# EAGLE design M133A (EAGLE 6.6.0)
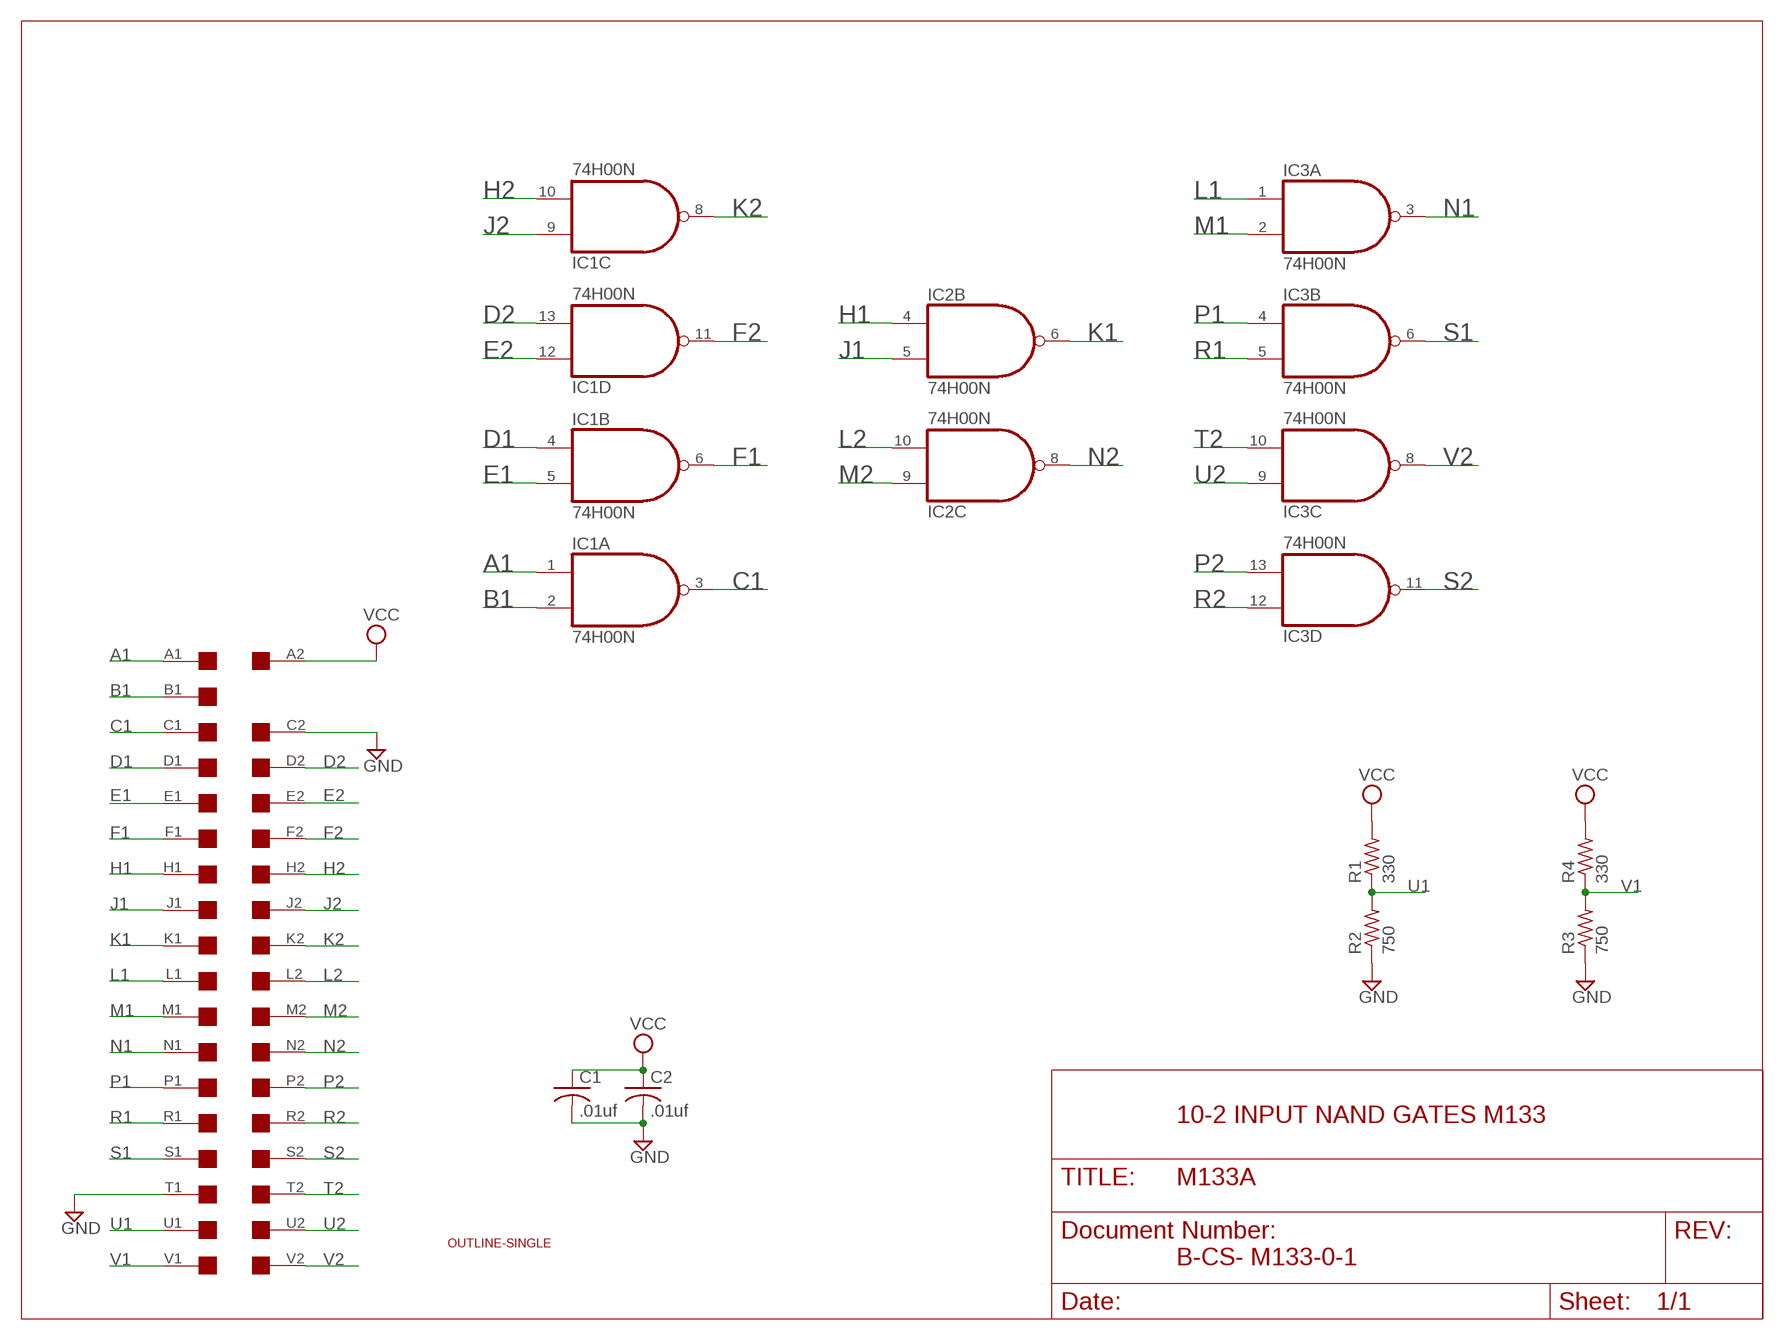
[diagram p0: schematic, sheet 1]

## Parts
C1  .01uf  C-US050-025X075  [C050-025X075]
C2  .01uf  C-US050-025X075  [C050-025X075]
IC1  74H00N  7400N  [DIL14]
IC2  74H00N  7400N  [DIL14]
IC3  74H00N  7400N  [DIL14]
R1  330  R-US_0207/10  [0207/10]
R2  750  R-US_0207/10  [0207/10]
R3  750  R-US_0207/10  [0207/10]
R4  330  R-US_0207/10  [0207/10]
U$1  OUTLINE-SINGLE  [SINGLE]
U$4  SINGLE  [EDGE-CON2]

## Nets
A1: IC1.1(A:I0) U$4.A1
B1: IC1.2(A:I1) U$4.B1
C1: IC1.3(A:O) U$4.C1
D1: IC1.4(B:I0) U$4.D1
D2: IC1.13(D:I1) U$4.D2
E1: IC1.5(B:I1) U$4.E1
E2: IC1.12(D:I0) U$4.E2
F1: IC1.6(B:O) U$4.F1
F2: IC1.11(D:O) U$4.F2
GND [Supply]: C1.2 C2.2 R2.1 R3.1 U$4.C2 U$4.T1
H1: IC2.4(B:I0) U$4.H1
H2: IC1.10(C:I1) U$4.H2
J1: IC2.5(B:I1) U$4.J1
J2: IC1.9(C:I0) U$4.J2
K1: IC2.6(B:O) U$4.K1
K2: IC1.8(C:O) U$4.K2
L1: IC3.1(A:I0) U$4.L1
L2: IC2.10(C:I1) U$4.L2
M1: IC3.2(A:I1) U$4.M1
M2: IC2.9(C:I0) U$4.M2
N1: IC3.3(A:O) U$4.N1
N2: IC2.8(C:O) U$4.N2
P1: IC3.4(B:I0) U$4.P1
P2: IC3.13(D:I1) U$4.P2
R1: IC3.5(B:I1) U$4.R1
R2: IC3.12(D:I0) U$4.R2
S1: IC3.6(B:O) U$4.S1
S2: IC3.11(D:O) U$4.S2
T2: IC3.10(C:I1) U$4.T2
U1: R1.1 R2.2 U$4.U1
U2: IC3.9(C:I0) U$4.U2
V1: R3.2 R4.1 U$4.V1
V2: IC3.8(C:O) U$4.V2
VCC [Supply]: C1.1 C2.1 R1.2 R4.2 U$4.A2
Unconnected: IC2.1(A:I0) IC2.2(A:I1) IC2.3(A:O) IC2.11(D:O) IC2.12(D:I0) IC2.13(D:I1) U$4.B2

## Notes on the sheet
- 10-2 INPUT NAND GATES M133
- B-CS- M133-0-1

## Power pins joined to a net without a drawn wire
GND: IC1.7(P:GND) IC2.7(P:GND) IC3.7(P:GND)
VCC: IC1.14(P:VCC) IC2.14(P:VCC) IC3.14(P:VCC)

## Library data of the parts
C1 C2 = rcl:C-US: CAPACITOR, American symbol
IC1-IC3 = 74xx-us:74*00: Quad 2-input NAND gate
R1-R4 = rcl:R-US_: RESISTOR, American symbol
U$1 = dec-con:OUTLINE-*: Board outlines for DEC boards.
U$4 = dec-con:SINGLE: Single-Height DEC board

## Net classes
1 Supply: width 0.813 mm

## Board
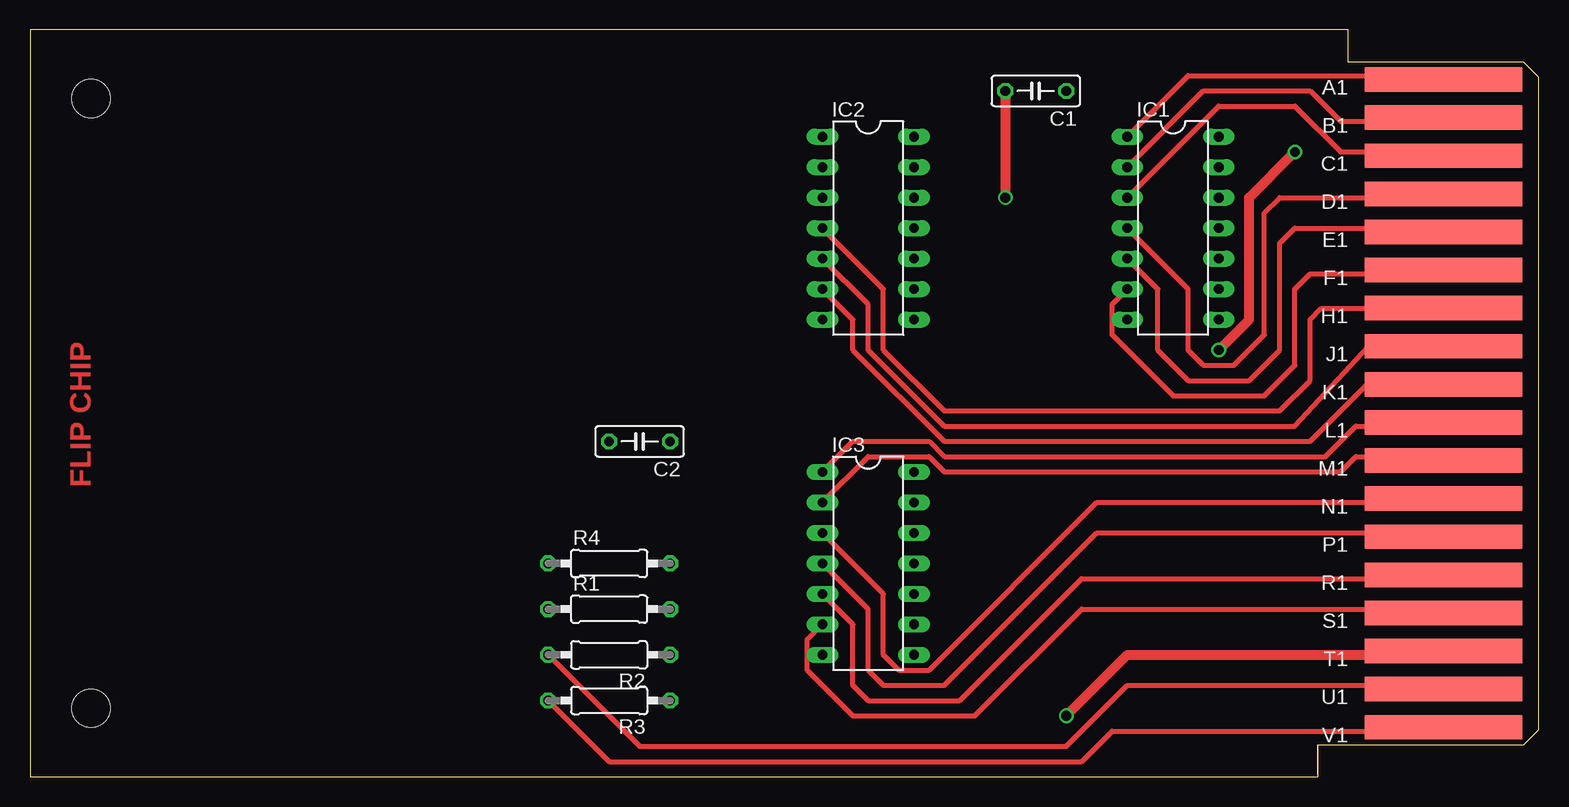
[diagram p1: board, top side]
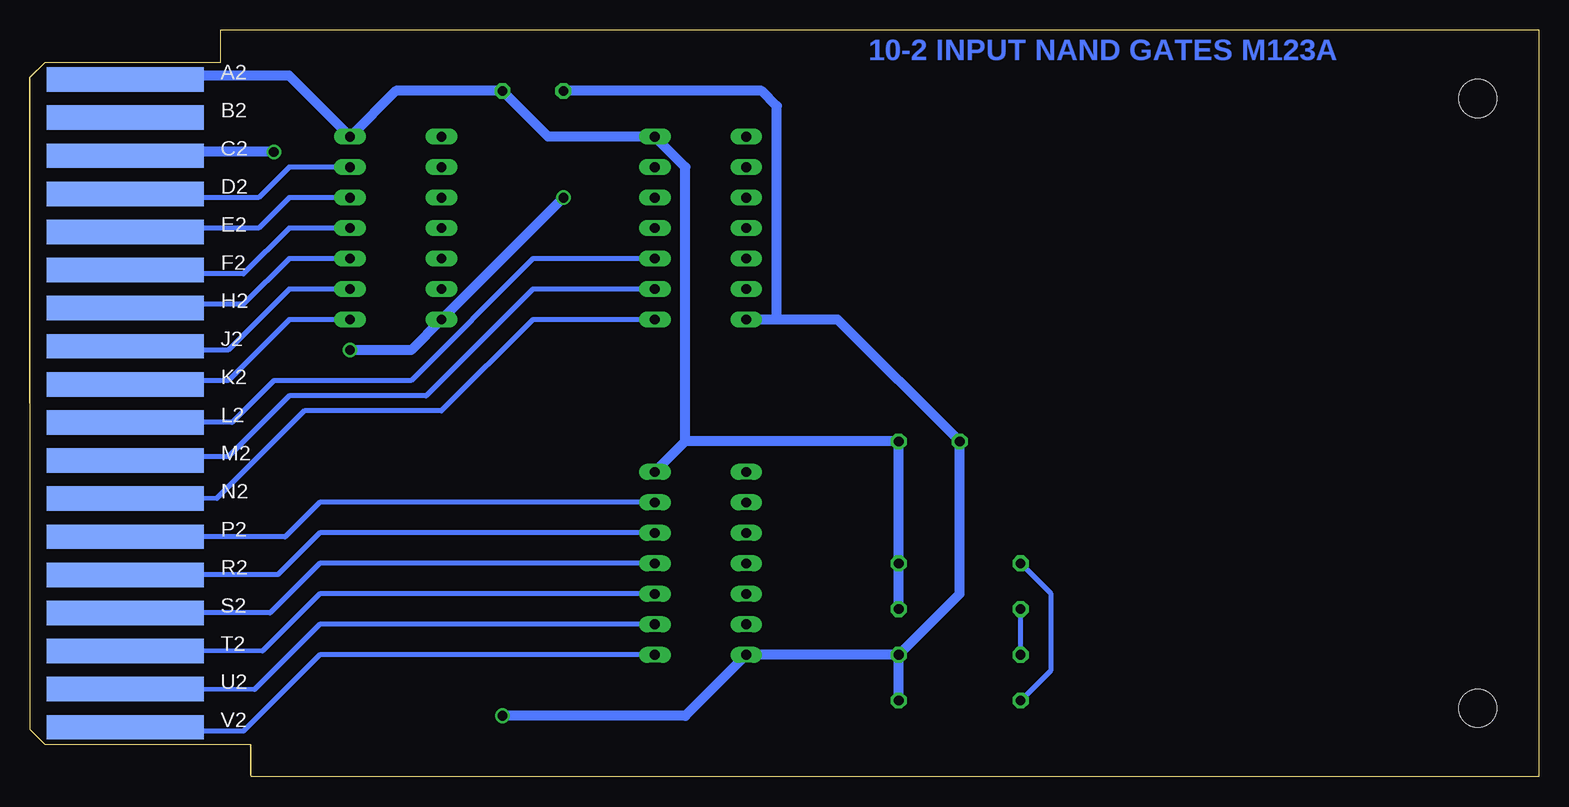
[diagram p2: board, bottom side, seen from below]

Size 125.73 x 62.23 mm. Coordinates in mm from the lower left corner, seen from the top.
Copper layers (1+16): Top 0.035mm / dielectric 1.5mm / Bottom 0.035mm
Design rules "16mils": minimum track width 16mil, minimum drill 32mil, track to track 15mil, track to pad 10mil, pad to pad 10mil, via to via 10mil, smd to smd 10mil, copper to edge 13mil, drill to drill 10mil, minimum pad ring 10mil, minimum via ring 8mil, stop-mask expansion 0mil, vias tented up to drill 0mil, thermal gap 10mil

### Footprints (pad centres in the part's own frame; a part is rotated, then mirrored left to right if it is on the bottom)
C050-025X075 = drill 0.813 octagon: 1 -2.54,0; 2 2.54,0
DIL14 = drill 0.813 long: 1 -7.62,-3.81; 2 -5.08,-3.81; 3 -2.54,-3.81; 4 0,-3.81; 5 2.54,-3.81; 6 5.08,-3.81; 7 7.62,-3.81; 8 7.62,3.81; 9 5.08,3.81; 10 2.54,3.81; 11 0,3.81; 12 -2.54,3.81; 13 -5.08,3.81; 14 -7.62,3.81
0207/10 = drill 0.813 octagon: 1 -5.08,0; 2 5.08,0
SINGLE = hole 3.175: 120.65,56.515; 120.65,5.715
EDGE-CON2 = smd 13.106 x 2.032: A1 7.938,4.128; B1 7.938,7.303; C1 7.938,10.477; D1 7.938,13.652; E1 7.938,16.828; F1 7.938,20.003; H1 7.938,23.177; J1 7.938,26.352; K1 7.938,29.527; L1 7.938,32.703; M1 7.938,35.877; N1 7.938,39.053; P1 7.938,42.227; R1 7.938,45.403; S1 7.938,48.578; T1 7.938,51.752; U1 7.938,54.928; V1 7.938,58.102 | smd 13.106 x 2.032 bottom: A2 7.938,4.128; B2 7.938,7.303; C2 7.938,10.477; D2 7.938,13.652; E2 7.938,16.828; F2 7.938,20.003; H2 7.938,23.177; J2 7.938,26.352; K2 7.938,29.527; L2 7.938,32.703; M2 7.938,35.877; N2 7.938,39.053; P2 7.938,42.227; R2 7.938,45.403; S2 7.938,48.578; T2 7.938,51.752; U2 7.938,54.928; V2 7.938,58.102

### Placement (x,y rotation side)
C1  83.82,57.15 180 top
C2  50.8,27.94 180 top
IC1  95.25,45.72 270 top
IC2  69.85,45.72 270 top
IC3  69.85,17.78 270 top
R1  48.26,13.97 0 top
R2  48.26,10.16 180 top
R3  48.26,6.35 180 top
R4  48.26,17.78 0 top
U$1  125.73,62.23 180 top
U$4  125.73,62.23 180 top

### Tracks (layer width: path | path; a pad name or v marks a point on that pad's centre or on a via)
A1
  Top 0.406: U$4.A1 112.16,58.02 111.76,58.42 96.52,58.42 IC1.1
B1
  Top 0.406: U$4.B1 112.05,54.9 111.76,54.61 109.22,54.61 106.68,57.15 97.79,57.15 IC1.2
C1
  Top 0.406: U$4.C1 112.09,51.74 111.76,52.07 109.22,52.07 105.41,55.88 99.06,55.88 IC1.3
D1
  Top 0.406: IC1.4 96.52,40.64 96.52,35.56 97.79,34.29 100.33,34.29 102.87,36.83 102.87,46.99 104.14,48.26 111.76,48.26 112.06,48.56 U$4.D1
D2
  Bottom 0.406: U$4.D2 112.06,48.56 111.76,48.26 106.68,48.26 104.14,50.8 IC1.13
E1
  Top 0.406: IC1.5 93.98,40.64 93.98,35.56 96.52,33.02 101.6,33.02 104.14,35.56 104.14,44.45 105.41,45.72 111.76,45.72 112.09,45.39 U$4.E1
E2
  Bottom 0.406: U$4.E2 112.09,45.39 111.76,45.72 106.68,45.72 104.14,48.26 IC1.12
F1
  Top 0.406: IC1.6 90.17,39.37 90.17,36.83 95.25,31.75 102.87,31.75 105.41,34.29 105.41,40.64 106.68,41.91 111.76,41.91 112.04,42.19 U$4.F1
F2
  Bottom 0.406: U$4.F2 112.04,42.19 111.76,41.91 107.95,41.91 104.14,45.72 IC1.11
GND  (via drill 0.81)
  Top 0.813: v105.41,52.07 101.6,48.26 101.6,38.1 v99.06,35.56 | C1.2 v81.28,48.26 | U$4.T1 112.09,10.49 111.76,10.16 91.44,10.16 v86.36,5.08
  Bottom 0.813: U$4.C2 112.09,51.74 111.76,52.07 v105.41,52.07 | v99.06,35.56 93.98,35.56 IC1.7 v81.28,48.26 | C1.2 64.77,57.15 63.5,55.88 63.5,38.1 | 63.5,38.1 IC2.7 | 63.5,38.1 58.42,38.1 C2.2 48.26,15.24 R2.1 | R3.1 R2.1 | R2.1 IC3.7 71.12,5.08 v86.36,5.08
H1
  Top 0.406: U$4.H1 107.62,39.04 106.68,38.1 106.68,33.02 104.14,30.48 76.2,30.48 71.12,35.56 71.12,40.64 IC2.4
H2
  Bottom 0.406: U$4.H2 112.09,39.04 111.76,39.37 107.95,39.37 104.14,43.18 IC1.10
J1
  Top 0.406: U$4.J1 111.58,35.89 105.41,29.21 76.2,29.21 69.85,35.56 69.85,39.37 IC2.5
J2
  Bottom 0.406: U$4.J2 111.76,35.56 109.22,35.56 108.89,35.89 104.14,40.64 IC1.9
K1
  Top 0.406: U$4.K1 111.45,32.72 106.68,27.94 76.2,27.94 68.58,35.56 68.58,38.1 IC2.6
K2
  Bottom 0.406: U$4.K2 112.06,32.72 111.76,33.02 109.22,33.02 104.14,38.1 IC1.8
L1
  Top 0.406: U$4.L1 112.09,29.54 111.76,29.21 110.49,29.21 107.95,26.67 76.2,26.67 74.93,27.94 68.58,27.94 IC3.1
L2
  Bottom 0.406: U$4.L2 108.89,29.54 105.41,33.02 93.98,33.02 83.82,43.18 IC2.10
M1
  Top 0.406: U$4.M1 112.09,26.34 111.76,26.67 110.49,26.67 109.22,25.4 76.2,25.4 74.93,26.67 69.85,26.67 IC3.2
M2
  Bottom 0.406: U$4.M2 112.09,26.34 111.76,26.67 109.22,26.67 104.14,31.75 92.71,31.75 83.82,40.64 IC2.9
N1
  Top 0.406: IC3.3 71.12,15.24 71.12,10.16 72.39,8.89 74.93,8.89 88.9,22.86 111.76,22.86 112.09,23.19 U$4.N1
N2
  Bottom 0.406: U$4.N2 110.16,23.19 102.87,30.48 91.44,30.48 83.82,38.1 IC2.8
P1
  Top 0.406: IC3.4 69.85,13.97 69.85,8.89 71.12,7.62 76.2,7.62 88.9,20.32 111.76,20.32 112.09,19.99 U$4.P1
P2
  Bottom 0.406: U$4.P2 104.47,19.99 101.6,22.86 IC3.13
R1
  Top 0.406: U$4.R1 112.09,16.84 111.76,16.51 87.63,16.51 77.47,6.35 69.85,6.35 68.58,7.62 68.58,12.7 IC3.5
R2
  Bottom 0.406: U$4.R2 105.08,16.84 101.6,20.32 IC3.12
S1
  Top 0.406: U$4.S1 112.06,13.66 111.76,13.97 87.63,13.97 78.74,5.08 68.58,5.08 64.77,8.89 64.77,11.43 IC3.6
S2
  Bottom 0.406: U$4.S2 105.72,13.66 101.6,17.78 IC3.11
T2
  Bottom 0.406: U$4.T2 106.35,10.49 101.6,15.24 IC3.10
U1
  Top 0.406: U$4.U1 112.12,7.26 111.76,7.62 91.44,7.62 86.36,2.54 50.8,2.54 R2.2
  Bottom 0.406: R2.2 R1.1
U2
  Bottom 0.406: U$4.U2 107.04,7.26 101.6,12.7 IC3.9
V1
  Top 0.406: U$4.V1 112.15,4.2 111.76,3.81 90.17,3.81 87.63,1.27 48.26,1.27 R3.2
  Bottom 0.406: R3.2 40.64,8.89 40.64,15.24 R4.1
V2
  Bottom 0.406: U$4.V2 112.15,4.2 111.76,3.81 107.95,3.81 101.6,10.16 IC3.8
VCC
  Bottom 0.813: U$4.A2 112.16,58.02 111.76,58.42 104.14,58.42 IC1.14 95.25,57.15 C1.1 82.55,53.34 IC2.14 71.12,50.8 71.12,27.94 | R1.2 R4.2 C2.1 71.12,27.94 | 71.12,27.94 IC3.14

### Text on the board
Top: FLIP CHIP
Bottom: 10-2 INPUT NAND GATES M123A
Document: Use M123A Etch!